# Altium schematic sheet MCU.SchDoc
size A4; Organization: Altium Limited; Address1: L3, 12a Rodborough Rd; Address2: Frenchs Forest; Address3: NSW; Address4: Australia 2086
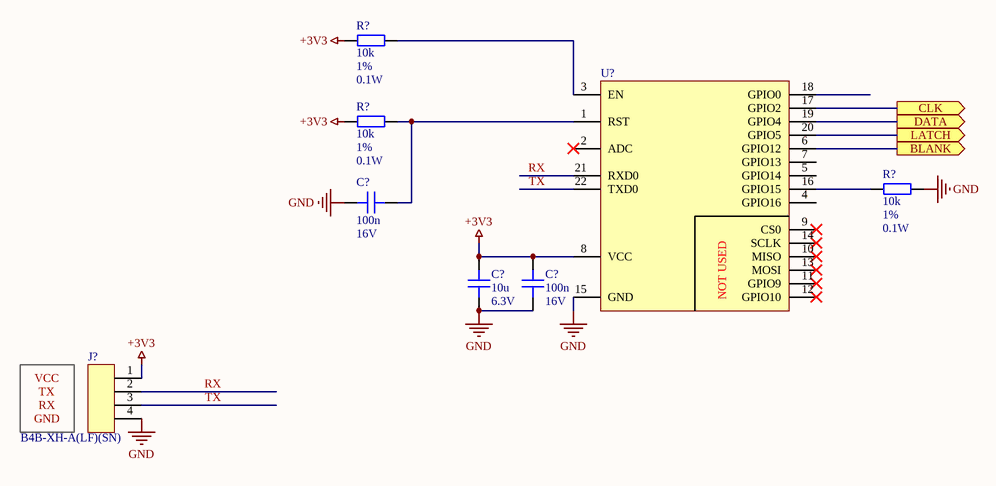
[diagram p0: MCU.SchDoc]

## Parts
(Parts that share a designator on the sheet are numbered #1, #2 ... from top to bottom, then left to right.)
C?#1  Capacitance: 100n  Voltage - Rated: 16V  [CAPC1608X09N]  (hidden comment: 0603B104K160NT)
C?#2  Capacitance: 10u  Voltage - Rated: 6.3V  [CAPC1608X09N]  (hidden comment: 0603X106K6R3NT)
C?#3  Capacitance: 100n  Voltage - Rated: 16V  [CAPC1608X09N]  (hidden comment: 0603B104K160NT)
J?  B4B-XH-A(LF)(SN)  [B4B-XH-A]
R?#1  Resistance: 10k  Tolerance: 1%  Power (Watts): 0.1W  [RESC1608X06N]  (hidden comment: WR06X1002FTL)
R?#2  Resistance: 10k  Tolerance: 1%  Power (Watts): 0.1W  [RESC1608X06N]  (hidden comment: WR06X1002FTL)
R?#3  Resistance: 10k  Tolerance: 1%  Power (Watts): 0.1W  [RESC1608X06N]  (hidden comment: WR06X1002FTL)
U?  ESP-12F  [ESP-12F]  (value not drawn)

## Ports
BLANK (out), CLK (out), DATA (out), LATCH (out)

## Nets
+3V3: C?#2.2 C?#3.2 J?.1 R?#1.1 R?#2.1 U?.8(VCC)
GND: C?#1.2 C?#2.1 C?#3.1 J?.4 R?#3.2 U?.15(GND)
BLANK: U?.6(GPIO12) ; port BLANK
CLK: U?.17(GPIO2) ; port CLK
DATA: U?.19(GPIO4) ; port DATA
LATCH: U?.20(GPIO5) ; port LATCH
RX: J?.2 U?.21(RXD0)
TX: J?.3 U?.22(TXD0)
NetC?#1_1: C?#1.1 R?#2.2 U?.1(RST)
NetR?#1_2: R?#1.2 U?.3(EN)
NetR?#3_1: R?#3.1 U?.16(GPIO15)

Not connected (* = marked no-connect by the designer): U? 2(ADC)* 4(GPIO16) 5(GPIO14) 7(GPIO13) 9(CS0)* 10(MISO)* 11(GPIO9)* 12(GPIO10)* 13(MOSI)* 14(SCLK)* 18(GPIO0)

## Notes on the sheet
- VCC
- TX
- RX
- GND
- Title:
- Author:
- Approved:
- Size:
- Date:
- Git Hash:
- A4
- Prj:
- SW Version:
- Variant:
- Edited:
- CONFIDENTIAL
- File:
- (in symbol ESP-12F) NOT USED

## Library data of the parts
C?#1 C?#3 = 0603B104K160NT: 16V 100nF X7R ±10% 0603 Multilayer Ceramic Capacitors MLCC - SMD/SMT ROHS; Manufacturer: FH (Guangdong Fenghua Advanced Tech); Product Status: Active; PartNumber: 0603B104K160NT; ComponentLink1URL: https://datasheet.lcsc.com/lcsc/2201241400_FH--Guangdong-Fenghua-Advanced-Tech-0603B104K160NT_C2846678.pdf; ComponentLink1Description: Datasheet; Package: 0603; Series: -; Tolerance: 10%; Temperature Coefficient: X7R; Operating Temperature: -55 - 125 ℃; Features: -; Ratings: -; Applications: -; Failure Rate: -; Mounting Type: SMT; Package/Case: 0603; Size/Dimension: 1.6 x 0.8mm; Height-Seated (Max): 0.8mm; Thickness (Max): -; Lead Spacing: -; Lead Style: -
C?#2 = 0603X106K6R3NT: 6.3V 10uF X5R ±10% 0603 Multilayer Ceramic Capacitors MLCC - SMD/SMT ROHS; Manufacturer: FH (Guangdong Fenghua Advanced Tech); Product Status: Active; PartNumber: 0603X106K6R3NT; ComponentLink1URL: https://datasheet.lcsc.com/lcsc/2201241400_FH--Guangdong-Fenghua-Advanced-Tech-0603B104K160NT_C2846678.pdf; ComponentLink1Description: Datasheet; Package: 0603; Series: -; Tolerance: 10%; Temperature Coefficient: X5R; Operating Temperature: -55 - 125 ℃; Features: -; Ratings: -; Applications: -; Failure Rate: -; Mounting Type: SMT; Package/Case: 0603; Size/Dimension: 1.6 x 0.8mm; Height-Seated (Max): 0.8mm; Thickness (Max): -; Lead Spacing: -; Lead Style: -
J? = CMP-00006-1: JST (JAPAN SOLDERLESS TERMINALS) - B4B-XH-A (LF)(SN) - Wire-To-Board-Steckverbinder, vertikal, 2.5 mm, 4 Kontakt(e), Stiftleiste, Baureihe XH; Voltage Rating (AC): 250V; Connector Type: Male Pin; Insulation Resistance: 1G; Current: 3A; Contact Resistance: 2m; Number of Positions: 4; Pitch: 2.5mm; Wire/Cable Gauge: 22AWG; Gender: Male; Number of Rows: 1; Max Operating Temperature: 85°C; Housing Color: White; Housing Material: Polyamide; Color: Natural; Length: 12.4mm; Contact Plating: Tin,Copper,Lead; Orientation: Straight; Lead Pitch: 2.5mm; Max Voltage Rating (AC): 250V; Contact Material: Brass; Termination: Press-Fit; Max Voltage Rating (DC): 250V; REACH SVHC: No SVHC; Lead Free: Lead Free; Max Current Rating: 3A; Depth: 5.75mm; Number of Contacts: 4; Voltage Rating: 250V; Packaging: Bulk; Min Operating Temperature: -25°C; Material: Polyamide; Current Rating: 3A; Mount: Through Hole; Package Quantity: 500
R?#1-R?#3 = WR06X1002FTL: 100mW 75V ±100ppm/℃ ±1% -55℃~+155℃ 10kΩ 0603 Chip Resistor - Surface Mount ROHS; Manufacturer: Walsin Tech Corp; Product Status: Active; PartNumber: WR06X1002FTL; ComponentLink1URL: https://datasheet.lcsc.com/lcsc/1811151132_Walsin-Tech-Corp-WR06X1002FTL_C108449.pdf; ComponentLink1Description: Datasheet; Package: 0603; Series: -; Composition: -; Features: -; Temperature Coefficient: 100ppm/℃; Operating Temperature: -55 -155 ℃; Package/Case: 0603; Ratings: 75V; Size/Dimension: 1.6 x 0.8mm; Height-Seated (Max): 0.6mm; Number of Terminations: -; Failure Rate: -
U? = ESP-12F: WIFI Module based on ESP8266EX; Manufacturer: Shenzhen Ai-Thinker Technology; Product Status: Active; RF Family/Standard: Wi-Fi; Protocol: 802.11b/g/n; Frequency: 2400 MHz ~ 2483.5 MHz; Data Rate: 72.2 Mbps; Power - Output: +17dBm max; Serial Interfaces: SPI, I2C, UART; Memory Size: 4MB Flash; Voltage - Supply: 3.0-3.6V; Current - Receiving: 0.056A; Current - Transmitting: 0.17A (peak up to 500mA); PartNumber: ESP-12F; ComponentLink1URL: https://docs.ai-thinker.com/_media/esp8266/docs/esp-12f_product_specification_en.pdf; ComponentLink1Description: Datasheet; Package: SMD-22; Series: -; Modulation: -; Sensitivity: -; Antenna Type: -; Utilized IC / Part: -; Mounting Type: SMT; Operating Temperature: -20 - 85 °C; Package / Case: SMD-22